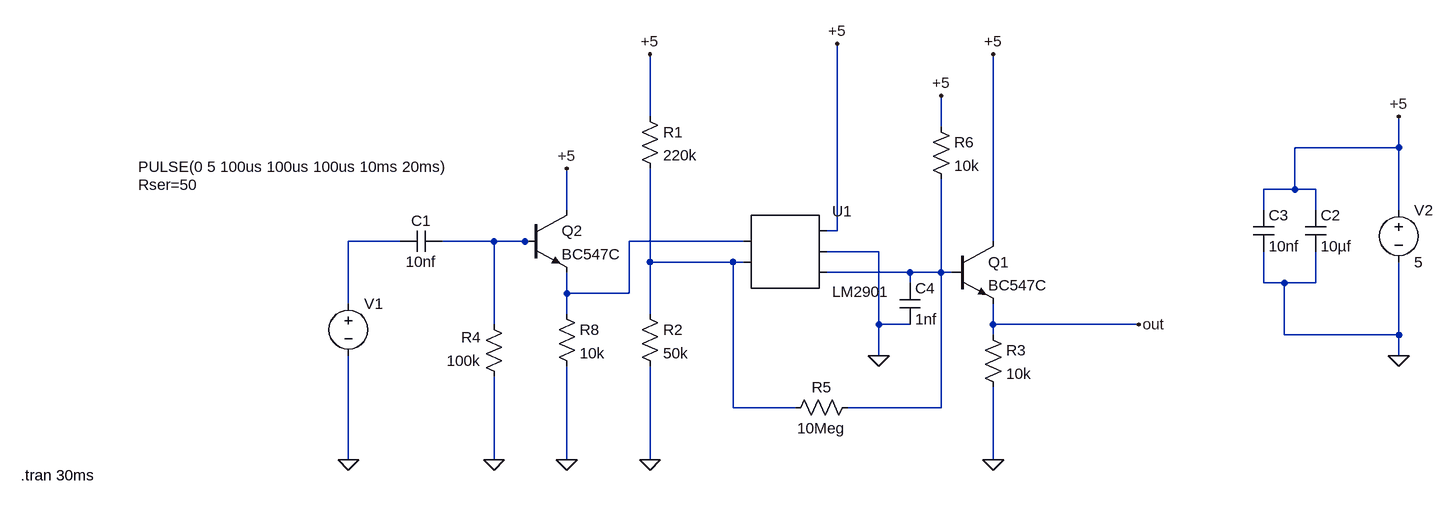
[diagram p0: schematic Wykrywacz_zbocza_wzr.asc]
Wykrywacz_zbocza_wzr.asc, the LTspice schematic file:
Version 4
SHEET 1 1256 680
WIRE 48 -48 48 -144
WIRE 496 -32 496 -80
WIRE 1200 0 1200 -48
WIRE 1200 0 1040 0
WIRE 1040 64 1040 0
WIRE 1040 64 992 64
WIRE 1072 64 1040 64
WIRE -80 96 -80 32
WIRE 992 96 992 64
WIRE 1072 96 1072 64
WIRE 1200 96 1200 0
WIRE 336 128 336 -160
WIRE 336 128 320 128
WIRE -336 144 -416 144
WIRE -192 144 -272 144
WIRE -144 144 -192 144
WIRE -128 144 -144 144
WIRE 192 144 16 144
WIRE 576 144 576 -144
WIRE 400 160 320 160
WIRE 48 176 48 32
WIRE 176 176 48 176
WIRE 192 176 176 176
WIRE 448 192 320 192
WIRE 496 192 496 48
WIRE 496 192 448 192
WIRE 512 192 496 192
WIRE 448 208 448 192
WIRE 992 208 992 160
WIRE 1024 208 992 208
WIRE 1072 208 1072 160
WIRE 1072 208 1024 208
WIRE -80 224 -80 192
WIRE 16 224 16 144
WIRE 16 224 -80 224
WIRE -416 240 -416 144
WIRE -80 256 -80 224
WIRE 48 256 48 176
WIRE -192 272 -192 144
WIRE 400 272 400 160
WIRE 448 272 400 272
WIRE 576 272 576 240
WIRE 800 272 576 272
WIRE 576 288 576 272
WIRE 1024 288 1024 208
WIRE 1200 288 1200 176
WIRE 1200 288 1024 288
WIRE 400 320 400 272
WIRE 1200 320 1200 288
WIRE 176 400 176 176
WIRE 272 400 176 400
WIRE 496 400 496 192
WIRE 496 400 352 400
WIRE -416 480 -416 320
WIRE -192 480 -192 352
WIRE -80 480 -80 336
WIRE 48 480 48 336
WIRE 576 480 576 368
FLAG 48 -144 +5
FLAG 576 -144 +5
FLAG 48 480 0
FLAG 576 480 0
FLAG -416 480 0
FLAG 800 272 out
FLAG 336 -160 +5
FLAG 400 320 0
FLAG -192 480 0
FLAG 1200 -48 +5
FLAG 1200 320 0
FLAG 496 -80 +5
FLAG -80 32 +5
FLAG -80 480 0
SYMBOL cap -272 128 R90
WINDOW 0 0 32 VBottom 2
WINDOW 3 32 32 VTop 2
SYMATTR InstName C1
SYMATTR Value 10nf
SYMBOL res 32 -64 R0
SYMATTR InstName R1
SYMATTR Value 220k
SYMBOL res 32 240 R0
SYMATTR InstName R2
SYMATTR Value 50k
SYMBOL res 560 272 R0
SYMATTR InstName R3
SYMATTR Value 10k
SYMBOL npn 512 144 R0
SYMATTR InstName Q1
SYMATTR Value BC547C
SYMBOL voltage -416 224 R0
WINDOW 3 -323 -195 Left 2
WINDOW 123 0 0 Left 0
WINDOW 39 -323 -167 Left 2
SYMATTR Value PULSE(0 5 100us 100us 100us 10ms 20ms)
SYMATTR SpiceLine Rser=50
SYMATTR InstName V1
SYMBOL voltage 1200 80 R0
WINDOW 123 0 0 Left 0
WINDOW 39 0 0 Left 0
SYMATTR InstName V2
SYMATTR Value 5
SYMBOL res 480 -48 R0
SYMATTR InstName R6
SYMATTR Value 10k
SYMBOL AutoGenerated\\LM2901 256 160 R0
SYMATTR InstName U1
SYMBOL cap 1056 96 R0
SYMATTR InstName C2
SYMATTR Value 10µf
SYMBOL cap 976 96 R0
SYMATTR InstName C3
SYMATTR Value 10nf
SYMBOL res 368 384 R90
WINDOW 0 0 56 VBottom 2
WINDOW 3 32 56 VTop 2
SYMATTR InstName R5
SYMATTR Value 10Meg
SYMBOL res -176 368 R180
WINDOW 0 36 76 Left 2
WINDOW 3 36 40 Left 2
SYMATTR InstName R4
SYMATTR Value 100k
SYMBOL npn -144 96 R0
SYMATTR InstName Q2
SYMATTR Value BC547C
SYMBOL res -96 240 R0
SYMATTR InstName R8
SYMATTR Value 10k
SYMBOL cap 432 208 R0
SYMATTR InstName C4
SYMATTR Value 1nf
TEXT -920 504 Left 2 !.tran 30ms

The netlist it stands for:
* Wykrywacz_zbocza_wzr.asc
C1 N002 N001 10nf
R1 +5 N004 220k
R2 N004 0 50k
R3 out 0 10k
Q1 +5 N005 out 0 BC547C
V1 N001 0 PULSE(0 5 100us 100us 100us 10ms 20ms) Rser=50
V2 +5 0 5
R6 +5 N005 10k
* U1: LM2901 (symbol AutoGenerated\LM2901 not available, pins judged from their places): pin1=N003 pin2=N004 pin3=+5 pin4=0 pin5=N005
C2 +5 0 10µf
C3 +5 0 10nf
R5 N005 N004 10Meg
R4 0 N002 100k
Q2 +5 N002 N003 0 BC547C
R8 N003 0 10k
C4 N005 0 1nf
.model NPN NPN
.model PNP PNP
.lib standard.bjt
.tran 30ms
.backanno
.end